# EAGLE design Esp8266_prot16_v4 (EAGLE 8.4.0)
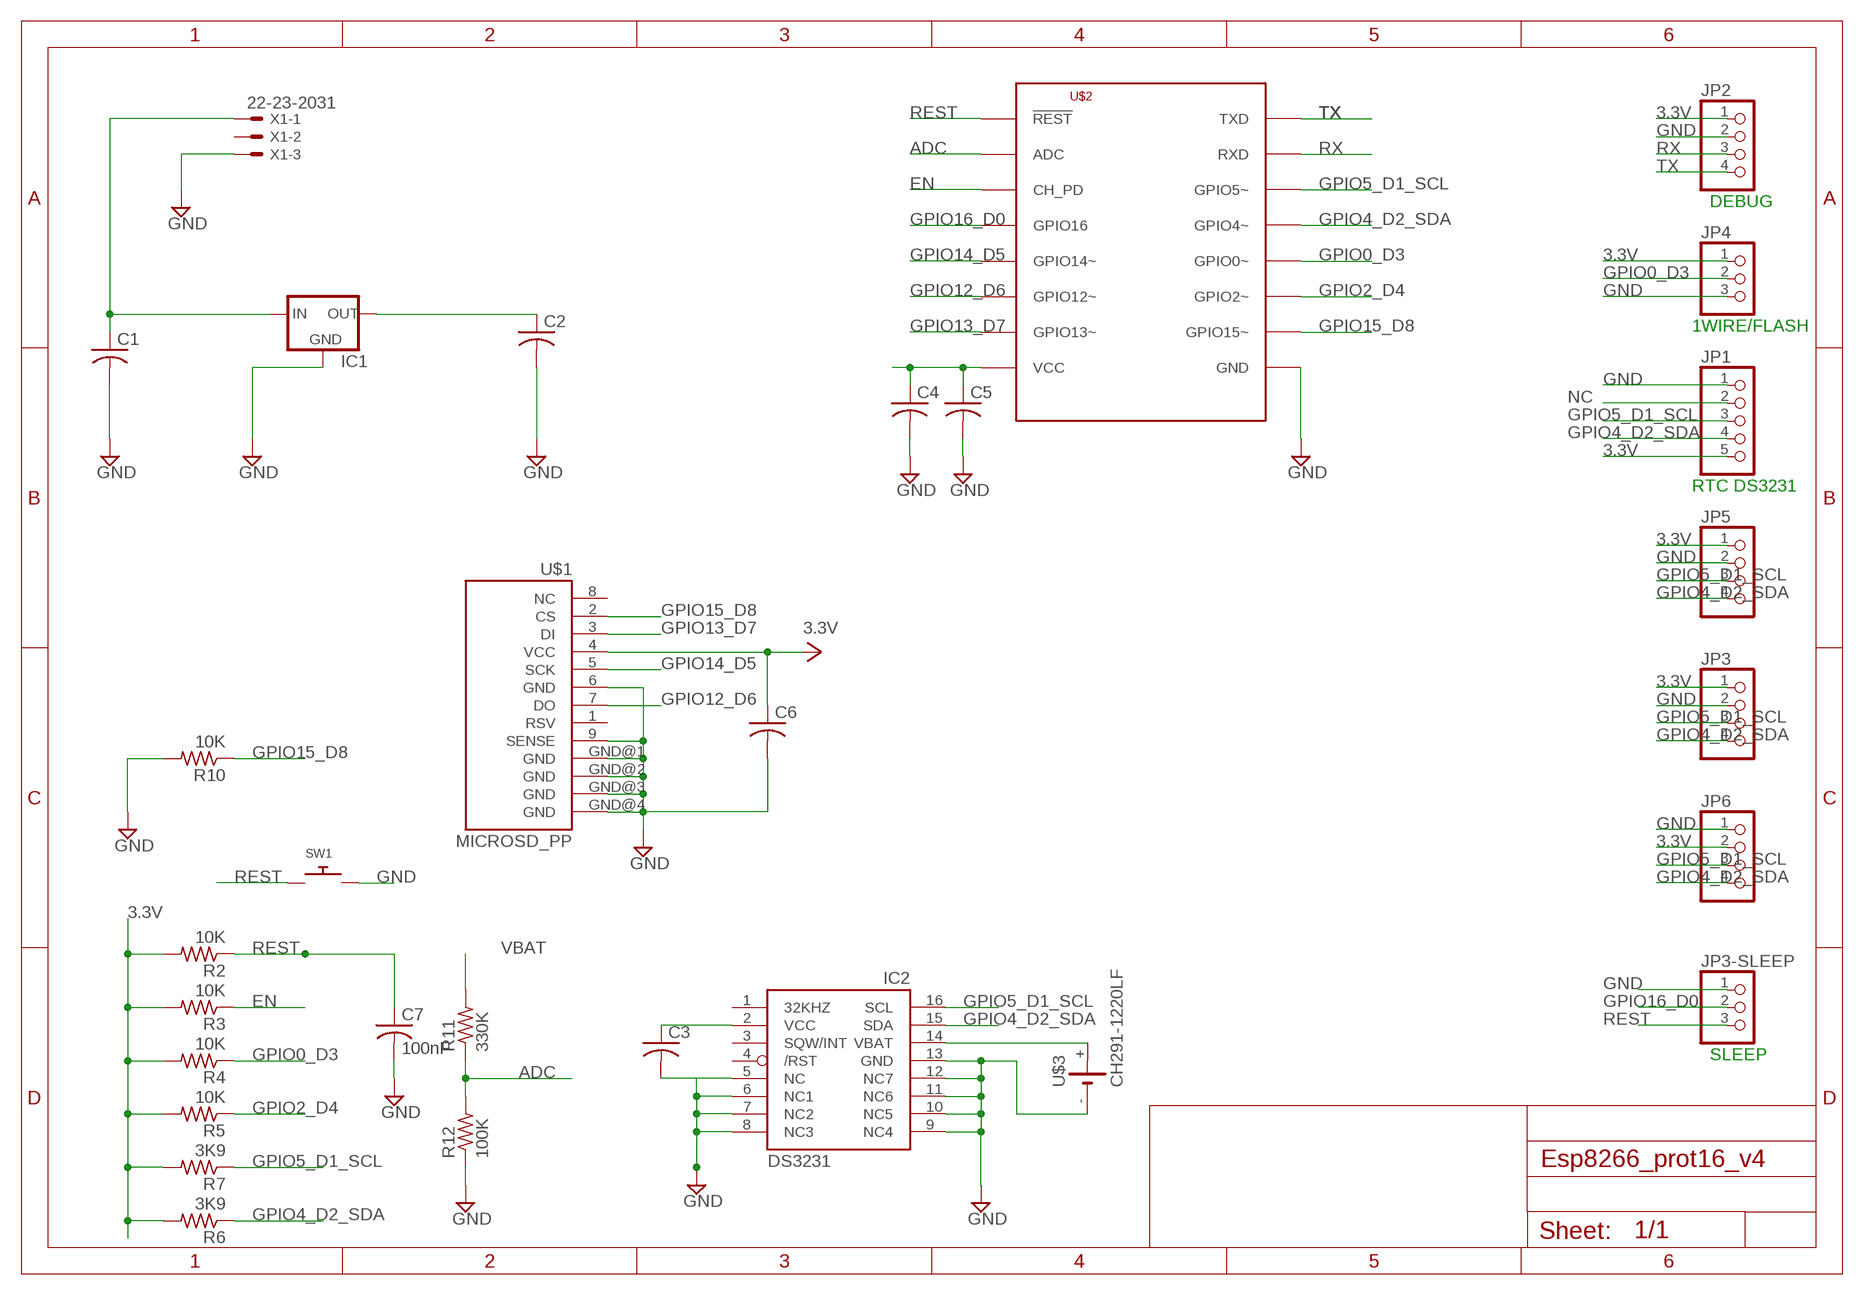
[diagram p0: schematic, sheet 1]

## Parts
C1  C-USC0805K  [C0805K]
C2  C-USC0805K  [C0805K]
C3  C-USC0805K  [C0805K]
C4  C-USC0805K  [C0805K]
C5  C-USC0805K  [C0805K]
C6  C-USC0805K  [C0805K]
C7  100nF  C-USC0805K  [C0805K]
IC1  XC63FPP  [SOT89R]
IC2  DS3231/SO  [SO16W]
JP1  PINHD-1X5/90  [1X05/90]
JP2  PINHD-1X4  [1X04]
JP3  PINHD-1X4/90  [1X04/90]
JP3-SLEEP  PINHD-1X3/90  [1X03/90]
JP4  PINHD-1X3  [1X03]
JP5  PINHD-1X4  [1X04]
JP6  PINHD-1X4  [1X04]
R2  10K  R-US_R0805  [R0805]
R3  10K  R-US_R0805  [R0805]
R4  10K  R-US_R0805  [R0805]
R5  10K  R-US_R0805  [R0805]
R6  3K9  R-US_R0805  [R0805]
R7  3K9  R-US_R0805  [R0805]
R10  10K  R-US_R0805  [R0805]
R11  330K  R-US_R0805  [R0805]
R12  100K  R-US_R0805  [R0805]
SW1  SWITCH_PUSHBUTTONEVQ-PE  [TACT_PANA-EVQ]
U$1  MICROSD_PP  [MICROSD_PP]
U$2  ESP8266-07  [ESP-07]
U$3  CH291-1220LF  [CH291-1220LF]
X1  22-23-2031  [22-23-2031]

## Nets
3.3V: C2.1 C3.1 C4.1 C5.1 C6.1 IC1.3(OUT) IC2.2(VCC) JP1.5 JP2.1 JP3.1 JP4.1 JP5.1 JP6.2 R2.2 R3.2 R4.2 R5.2 R6.2 R7.2 U$1.4(VCC) U$2.VCC
ADC: R11.1 R12.2 U$2.ADC
BATRTC: IC2.14(VBAT) U$3.+
EN: R3.1 U$2.CH_PD
GND: C1.2 C2.2 C3.2 C4.2 C5.2 C6.2 C7.2 IC1.1(GND) IC2.5(NC) IC2.6(NC1) IC2.7(NC2) IC2.8(NC3) IC2.9(NC4) IC2.10(NC5) IC2.11(NC6) IC2.12(NC7) IC2.13(GND) JP1.1 JP2.2 JP3-SLEEP.1 JP3.2 JP4.3 JP5.2 JP6.1 R10.2 R12.1 SW1.P$2 U$1.6(GND) U$1.9(SENSE) U$1.GND@1(GND) U$1.GND@2(GND) U$1.GND@3(GND) U$1.GND@4(GND) U$2.GND U$3.- X1.3
GPIO0_D3: JP4.2 R4.1 U$2.GPIO0(GPIO0~)
GPIO2_D4: R5.1 U$2.GPIO2(GPIO2~)
GPIO4_D2_SDA: IC2.15(SDA) JP1.4 JP3.4 JP5.4 JP6.4 R6.1 U$2.GPIO5(GPIO4~)
GPIO5_D1_SCL: IC2.16(SCL) JP1.3 JP3.3 JP5.3 JP6.3 R7.1 U$2.GPIO4(GPIO5~)
GPIO12_D6: U$1.7(DO) U$2.GPIO12(GPIO12~)
GPIO13_D7: U$1.3(DI) U$2.GPIO13(GPIO13~)
GPIO14_D5: U$1.5(SCK) U$2.GPIO14(GPIO14~)
GPIO15_D8: R10.1 U$1.2(CS) U$2.GPIO15(GPIO15~)
GPIO16_D0: JP3-SLEEP.2 U$2.GPIO16
NC: JP1.2
REST: C7.1 JP3-SLEEP.3 R2.1 SW1.P$1 U$2.REST(!REST)
RX: JP2.3 U$2.RXD
TX: JP2.4 U$2.TXD
VBAT: C1.1 IC1.2(IN) R11.2 X1.1
Unconnected: IC2.1(32KHZ) IC2.3(SQW/INT) IC2.4(/RST) U$1.1(RSV) U$1.8(NC) X1.2

## Notes on the sheet
- DEBUG
- 1WIRE/FLASH
- RTC DS3231
- SLEEP

## Library data of the parts
C1-C7 = adafruit:C-US: CAPACITOR, American symbol
IC1 = v-reg:XC63FP: Positiv Voltage Regulators www.torex.co.jp/english/product/pro02/pdf/0201_xc62fp.pdf
IC2 = adafruit:DS3231
JP1 = pinhead:PINHD-1X5: PIN HEADER
JP2 JP3 JP5 JP6 = pinhead:PINHD-1X4: PIN HEADER
JP3-SLEEP JP4 = pinhead:PINHD-1X3: PIN HEADER
R2-R7 R10-R12 = adafruit:R-US_: RESISTOR, American symbol
SW1 = adafruit:SWITCH_PUSHBUTTON: Buttons SOFTTOUCHSMD_SJ - Soft touch temporary push button (Super Junk Akihabara) Compatible with SKPMANE010 [Mouser: 688-SKPMAN] C&K_KSS = Digikey: KSS221GLFS
U$1 = DE1594-v2:MICROSD_PP
U$2 = lio:ESP8266
U$3 = battery:CH291-1220LF: Battery Holder, SMT, 12mm multicomp PART NO. CH291-1220LF Source: Data sheet <http://www.farnell.com/datasheets/1505860.pdf>
X1 = con-molex:22-23-2031: .100" (2.54mm) Center Header - 3 Pin; MF: MOLEX; MPN: 22-23-2031; OC_FARNELL: 1462950; OC_NEWARK: 30C0862

## Board
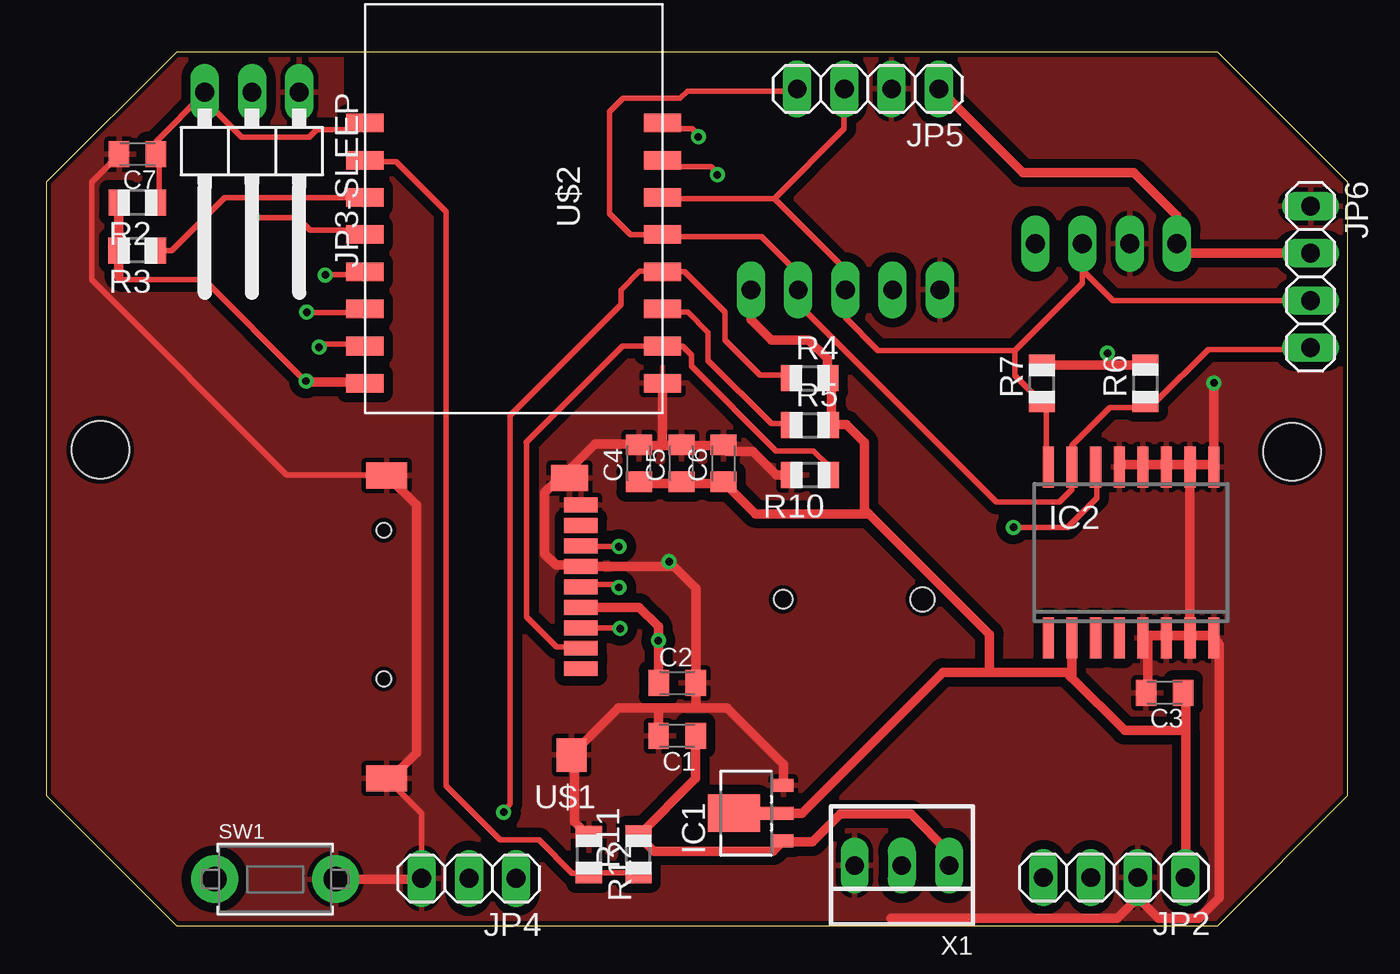
[diagram p1: board, top side]
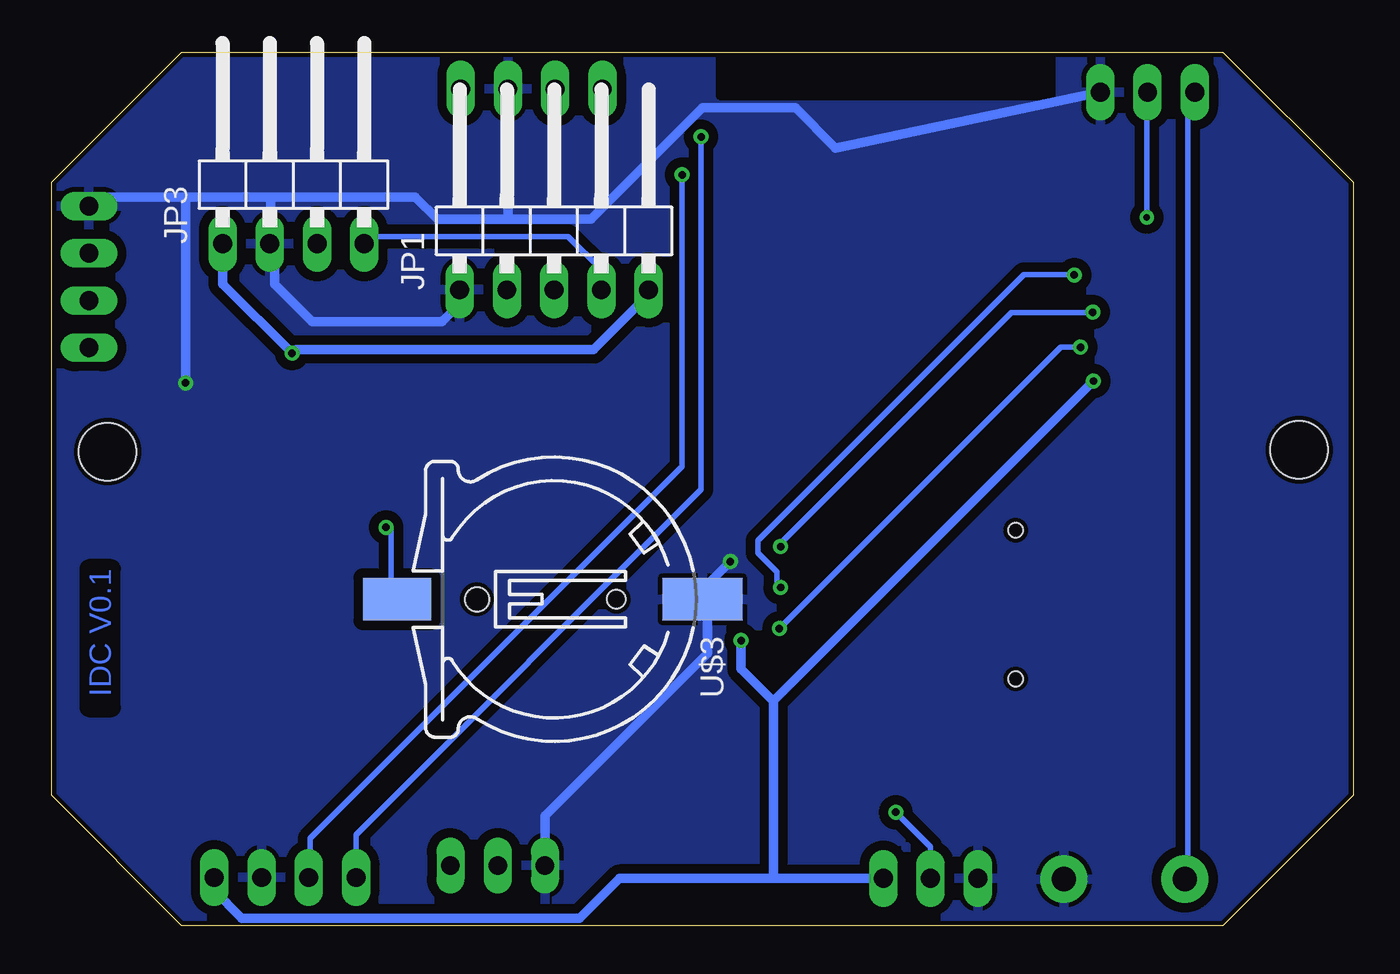
[diagram p2: board, bottom side, seen from below]

Size 70 x 47 mm. Coordinates in mm from the lower left corner, seen from the top.
Outline: 63,47 7,47 0,40 0,7 7,0 63,0 70,7 70,40 63,47
Copper layers (1*16): Top 0.035mm / dielectric 1.5mm / Bottom 0.035mm
Design rules "default *": minimum track width 0.3mm, minimum drill 0.4mm, track to track 20mil, track to pad 15mil, pad to pad 6mil, via to via 6mil, smd to smd 6mil, copper to edge 0.00761875mm, drill to drill 0.5mm, minimum pad ring 10mil, minimum via ring 8mil, stop-mask expansion 4mil, vias tented up to drill 0mil, thermal gap 10mil
Holes 3.1 mm at 2.9,25.6 67,25.5

### Footprints (pad centres in the part's own frame; a part is rotated, then mirrored left to right if it is on the bottom)
C0805K = smd 1.1 x 1.4: 1 -1,0; 2 1,0
SOT89R = smd 0.7 x 1.1: 1 1.5,-1.75; 2 -1.5,-1.75 | smd 0.7 x 1.8: 3 0,-1.4 | smd 2 x 2.8: 4 0,0.9
SO16W = smd 0.6 x 2.2: 1 -4.445,-4.6; 2 -3.175,-4.6; 3 -1.905,-4.6; 4 -0.635,-4.6; 5 0.635,-4.6; 6 1.905,-4.6; 7 3.175,-4.6; 8 4.445,-4.6; 9 4.445,4.6; 10 3.175,4.6; 11 1.905,4.6; 12 0.635,4.6; 13 -0.635,4.6; 14 -1.905,4.6; 15 -3.175,4.6; 16 -4.445,4.6
1X05/90 = drill 1.016 long: 1 -5.08,-3.81; 2 -2.54,-3.81; 3 0,-3.81; 4 2.54,-3.81; 5 5.08,-3.81
1X04 = drill 1.016 long: 1 -3.81,0; 2 -1.27,0; 3 1.27,0; 4 3.81,0
1X04/90 = drill 1.016 long: 1 -3.81,-3.81; 2 -1.27,-3.81; 3 1.27,-3.81; 4 3.81,-3.81
1X03/90 = drill 1.016 long: 1 -2.54,-3.81; 2 0,-3.81; 3 2.54,-3.81
1X03 = drill 1.016 long: 1 -2.54,0; 2 0,0; 3 2.54,0
R0805 = smd 1.1 x 1.4: 1 -1,0; 2 1,0
TACT_PANA-EVQ = drill 1.3 pad 2.54: P$1 -3.25,0; P$2 3.25,0
MICROSD_PP = smd 1.8 x 0.8: 1 0,3.85; 2 0,2.75; 3 0,1.65; 4 0,0.55; 5 0,-0.55; 6 0,-1.65; 7 0,-2.75; 8 0,-3.85; 9 0,-4.95 | smd 1.6 x 1.8: GND@1 0.5,8.5 | smd 2.2 x 1.4: GND@2 10.45,9.75; GND@4 10.45,-6.55 | smd 2 x 1.4: GND@3 0.6,-6.4 | hole 0.8: 10.6,4.4; 10.6,-3.6
ESP-07 = smd 1 x 2: ADC -1.6,-8; CH_PD 0.4,-8; GND 10.4,8; GPIO0 4.4,8; GPIO2 6.4,8; GPIO4 0.4,8; GPIO5 2.4,8; GPIO12 6.4,-8; GPIO13 8.4,-8; GPIO14 4.4,-8; GPIO15 8.4,8; GPIO16 2.4,-8; REST -3.6,-8; RXD -1.6,8; TXD -3.6,8; VCC 10.4,-8
CH291-1220LF = smd 2.3 x 3.66: + 0,-2.296 | smd 2.3 x 4.3: - 0,14.146 | hole 1.3: 0,2 | hole 1: 0,9.5
22-23-2031 = drill 1 long: 1 -2.54,0; 2 0,0; 3 2.54,0

### Placement (x,y rotation side)
C1  33.92,10.21 180 top
C2  33.93,13.05 0 top
C3  60.15,12.53 180 top
C4  31.87,24.87 90 top
C5  34.15,24.87 90 top
C6  36.42,24.87 90 top
C7  4.9,41.5 180 top
IC1  37.89,6.05 90 top
IC2  58.34,20.07 0 top
JP1  42.98,38.01 0 bottom
JP2  57.45,2.58 180 top
JP3  57,40.5 0 bottom
JP3-SLEEP  11.05,41.02 180 top
JP4  22.72,2.53 180 top
JP5  44.2,45.01 180 top
JP6  68,34.9 270 top
R2  4.89,38.9 180 top
R3  4.88,36.32 180 top
R4  41.07,29.45 0 top
R5  41.08,26.92 0 top
R6  59.12,29.18 90 top
R7  53.55,29.17 90 top
R10  41.07,24.23 180 top
R11  31.84,3.83 90 top
R12  29.17,3.82 270 top
SW1  12.3,2.5 0 top
U$1  28.75,17.67 180 top
U$2  25.13,39.58 270 top
U$3  49.13,17.55 270 bottom
X1  46.01,3.24 180 top

### Tracks (layer width: path | path; a pad name or v marks a point on that pad's centre or on a via)
3.3V  (via drill 0.4)
  Top 0.3: 32.17,23.79 C4.1 | 33.87,23.79 C5.1 34.21,23.79 | 36.25,23.79 C6.1 36.59,23.84 | 59.1,30.17 R6.2 | 57.08,30.2 57.11,30.17 | 17.02,29.24 U$2.VCC | 13.96,29.24 v13.96,29.29 13.74,29.49 8.48,34.74 4.04,34.74 3.88,34.92 | 48.01,44.9 JP5.1 | 42.22,27.24 42.09,26.96 R5.2 42.22,26.9 | 42.22,29.28 R4.2 | 61.29,12.26 C3.1 | 61.29,2.72 JP2.1 | 55.16,14.3 55.16,15.32 IC2.2 | 3.89,36.4 3.89,36.23 R3.2 | 32.91,13.07 C2.1
  Top 0.5: 33.87,23.79 32.17,23.79 | 36.25,23.79 34.21,23.79 | 59.1,30.17 57.11,30.17 R7.2 | v57.08,30.79 57.08,30.2 | 13.96,29.24 17.02,29.24 | JP5.1 52.52,40.5 58.5,40.5 60.81,38.19 JP3.1 61.33,36.17 JP6.2 | 42.22,29.28 42.22,27.24 | 61.29,10.5 61.29,2.72 | 61.29,10.5 61.29,12.26 | 44.24,22.15 50.73,15.66 50.73,13.62 | R4.2 42,29.51 42,30.5 41,31.5 39,31.5 37.9,32.6 JP1.5 | 55.17,13.33 IC2.2 | 55.17,13.33 58,10.5 61.29,10.5 | C6.1 38.13,22.15 44.24,22.15 | 44.24,22.15 44,22.4 44,26 43.04,26.96 42.09,26.96 | v32.91,15.34 32.91,16.09 31.88,17.12 U$1.4 | 55.17,13.33 54.88,13.62 50.73,13.62 | v32.91,15.34 32.9,15.32 | IC1.3 40.65,6.05 48.22,13.62 50.73,13.62 | 3.89,36.4 R2.2 | v13.96,29.29 v13.95,29.3 | 3.88,34.92 R3.2 | v32.91,15.34 32.91,13.07
  Bottom 0.3: 32.69,15.28 v32.91,15.34 | 56.86,30.94 v57.08,30.79 56.86,30.98 | 61.29,2.38 JP2.1 | 37.8,34.05 JP1.5
  Bottom 0.5: JP3.1 60.81,34.52 v57.08,30.79 | 56.86,30.98 40.86,30.98 37.8,34.05 | v32.91,15.34 32.91,13.8 31.18,12.07 | 31.18,12.07 v13.96,29.29 | 61.29,2.38 61.29,1.91 59.77,0.4 41.6,0.4 39.47,2.53 31,2.53 | 31,2.53 JP4.1 | 31.18,12.07 31.18,2.71 31,2.53
ADC
  Top 0.3: U$2.ADC 17.14,41.09 18.81,41.09 21.49,38.4 21.49,7.5 24.4,4.6 26.5,4.6 28.28,2.82 R12.2 29.19,2.83 R11.1
BATRTC  (via drill 0.4)
  Top 0.3: v52.02,21.43 54.93,21.43 56.5,23 56.5,24.61 IC2.14
  Bottom 0.3: v52.02,21.43 51.76,21.41 51.76,17.66 U$3.+
EN
  Top 0.3: U$2.CH_PD 17.02,38.77 | U$2.CH_PD 16.81,39.5 | 6.06,36.36 R3.1 6.72,36.32 9.58,39.18 U$2.CH_PD
GND  (via drill 0.4, 0.4 pad 0.7)
  Top 0.3: U$1.GND@2 18.39,7.79 18.73,7.79 U$1.GND@2 | 18.39,24.13 U$1.GND@4 18.18,24.24 12.93,24.24 2.42,34.74 2.42,40 3.64,41.21 C7.2 | 18.05,7.79 U$1.GND@2 | 57.88,24.81 IC2.13 | 58.91,24.81 IC2.12 59.25,24.81 | 61.29,24.81 IC2.10 | 60.27,24.81 IC2.11 | 62.65,15.62 IC2.8 62.65,15.32 | C3.2 59.25,12.56 | 59.25,15.28 IC2.5 59.25,15.62 | 61.29,15.62 IC2.7 61.63,15.62 | 60.27,15.62 IC2.6 | 61.63,24.47 IC2.10 | 32.17,25.84 C4.2 31.83,25.84 | 33.87,25.84 C5.2 | 36.25,25.84 C6.2 | 34.21,25.84 C5.2 | 39.98,24.34 R10.2 39.84,24.52 | 36.59,25.84 C6.2 | 33.37,28.9 U$2.GND | 33.87,26.18 C5.2 | 28.94,19.37 U$1.6 28.6,19.37 | 33.74,19.32 v33.49,19.58 33.71,19.37 | 28.26,9.15 U$1.GND@1 | 28.26,24.13 U$1.GND@3 27.92,23.79 27.58,23.79 | 62.8,24.8 IC2.9 | IC2.10 61.52,24.8 | 18.05,7.83 U$1.GND@2 | 36.59,25.88 C6.2 | 35,12.98 C2.2 | 34.93,11.73 34.9,11.7 | 32.92,11.52 33.1,11.7 | JP4.3 20.18,6.03 U$1.GND@2
  Top 0.5: 58.91,24.81 57.88,24.81 | 59.25,24.81 60.27,24.81 61.29,24.81 | 62.65,15.62 61.63,15.62 | 59.25,15.28 59.25,12.56 | 59.25,15.62 60.27,15.62 61.29,15.62 | 33,25.84 33.87,25.84 | 33,25.84 32.17,25.84 | 34.21,25.84 36.25,25.84 36.59,25.5 38,25.5 39.27,24.23 R10.2 | 33.74,19.32 U$1.6 28.68,19.39 27.59,19.39 27.58,19.4 27.4,19.4 26.8,20 26.8,23.3 27.29,23.79 27.58,23.79 | v62.8,29.2 62.8,24.8 61.52,24.8 | U$2.GND 33.13,25.97 33,25.84 | 39.45,7.55 IC1.1 39.64,8.66 36.6,11.7 34.9,11.7 33.1,11.7 30.78,11.7 U$1.GND@1 28.42,9 28.42,5.58 R12.1 | 58.72,1.5 58.72,1.49 59.8,0.4 62,0.4 63.1,1.5 63.1,15.16 IC2.8 | 58.72,1.5 JP2.2 | 45.44,0.4 57.61,0.4 58.72,1.5 | U$1.GND@4 19.9,22.62 19.9,9.3 18.39,7.79 | C4.2 31.84,25.9 29.5,25.9 28.26,24.66 28.26,24.13 | IC2.10 IC2.7 | v33.49,19.58 34.93,18.14 C2.2 34.93,11.73 | C1.2 32.92,11.52 | SW1.P$2 20.15,2.5 JP4.3
  Bottom 0.3: 34.73,18.34 34.73,17.66 34.95,17.57 U$3.- 34.73,17.32 | 34.73,14.6 34.73,14.64 | 45.63,44.9 JP5.2 | 67.93,38.63 JP6.1 | 45.47,38.06 45.53,38 | 58.23,36.77 JP3.2
  Bottom 0.5: JP3-SLEEP.1 27.84,41.84 30,44 35,44 41,38 45.53,38 49.25,38 50.45,39.2 58.23,39.2 | 34.73,17.32 34.73,14.64 43.47,5.9 X1.3 | 58.23,39.2 63,39.2 | JP5.2 45.47,38.06 | 63,39.2 67.36,39.2 67.93,38.63 | v62.8,29.2 62.8,39 63,39.2 | JP1.1 48.06,33.44 49,32.5 56,32.5 58,34.5 58,36.42 JP3.2 | 58.23,39.2 58.23,36.77 | v33.49,19.58 34.95,18.13 34.95,17.57
  pour Bottom (isolate 0.254): 0,7 7,0 63,0 70,7 70,40 63,47 7,47 0,40
  pour Top (isolate 0.254): 0,40 0,7 7,0 63,0 70,7 70,40 63,47 7,47
GPIO0_D3  (via drill 0.4)
  Top 0.3: 33.37,35.37 U$2.GPIO0 | R4.1 39.84,29.62 38.38,29.62 36.5,31.5 36.5,33 34.32,35.18 U$2.GPIO0 | 33.37,35.41 U$2.GPIO0 | U$2.GPIO0 33.31,35 | U$2.GPIO0 32.96,35.2 31.9,35.2 30.9,34.2 30.9,33.4 24.94,27.43 24.94,6.54 v24.6,6.1
  Bottom 0.3: 24.5,6 v24.6,6.1 22.73,4.22 JP4.2
GPIO2_D4
  Top 0.3: 33.37,33.33 U$2.GPIO2 | 39.84,27.24 R5.1 39.99,27 39,27 35.6,30.4 35.6,31.9 34.5,33 33.31,33 U$2.GPIO2 | 33.37,33.03 U$2.GPIO2
GPIO4_D2_SDA
  Top 0.3: R6.1 58.91,27.88 57.2,27.88 55.16,25.84 55.16,24.81 IC2.15 55.16,24.47 55.16,23.45 54.5,22.79 51.1,22.79 40.44,33.45 | U$2.GPIO5 33.37,37.07 38.48,37.07 40.44,35.11 JP1.4 40.44,33.45 | 32.35,37.41 33.03,37.41 U$2.GPIO5 | JP5.4 40.18,44.9 34.48,44.9 34.08,44.51 31.01,44.51 30.3,43.8 30.3,38.3 31.42,37.18 U$2.GPIO5 | 59.25,28.22 R6.1 | 40.44,33.45 40.34,33.55 | R6.1 59.68,28.18 62.5,31 67.91,31 JP6.4
  Bottom 0.3: JP3.4 52.81,37.07 42.22,37.07 40.44,35.29 JP1.4
GPIO5_D1_SCL
  Top 0.3: IC2.16 53.8,24.81 53.8,27.88 R7.1 53.46,28.22 52.1,29.58 52.1,30.94 | 39.16,39.11 33.37,39.11 U$2.GPIO4 | 39.16,39.11 42.9,42.86 42.9,44.9 JP5.3 | 42.98,34.4 42.98,32.7 44.74,30.94 52.1,30.94 | 42.98,34.4 JP1.3 | 42.98,34.4 42.98,35.29 39.16,39.11 | JP6.3 57.37,33.63 55.73,35.27 | JP3.3 55.73,35.27 | 52.1,30.94 55.73,34.58 55.73,35.27
GPIO12_D6  (via drill 0.4)
  Top 0.3: v30.79,20.39 30.64,20.39 28.94,20.39 U$1.7 | v14,33 14.3,32.99 17.02,32.99 U$2.GPIO12
  Bottom 0.3: v30.79,20.39 30.64,20.73 18.39,32.99 14.3,32.99 v14,33
GPIO13_D7  (via drill 0.4)
  Top 0.3: 17.37,31.28 U$2.GPIO13 17.02,31.28 14.98,31.28 v14.66,31.11 14.7,31.08 | U$1.3 30.78,16.02 v30.86,15.98
  Bottom 0.3: v30.86,15.98 15.72,31.11 v14.66,31.11
GPIO14_D5  (via drill 0.4)
  Top 0.3: v30.79,18.19 30.64,18.34 28.94,18.34 U$1.5 | v15,35 15.32,35.03 17.02,35.03 U$2.GPIO14
  Bottom 0.3: v30.79,18.19 30.98,18.34 30.98,19.02 32.01,20.05 32.01,20.73 17.71,35.03 15.32,35.03 v15,35
GPIO15_D8
  Top 0.3: 28.6,14.94 U$1.2 28.68,14.99 27.43,14.99 25.82,16.6 25.82,25.98 25.8,26 30.98,31.18 U$2.GPIO15 | 33.03,30.94 U$2.GPIO15 | R10.1 42.08,24.72 41.26,25.54 39.26,25.54 34.7,30.09 34.7,30.7 34.22,31.18 U$2.GPIO15 | 33.37,31.33 U$2.GPIO15 | U$2.GPIO15 33.31,31
GPIO16_D0  (via drill 0.35)
  Top 0.3: U$2.GPIO16 17.02,37.41 14.19,37.41 13.5,38.1 v11.1,38.1
  Bottom 0.3: v11.1,38.1 11.1,44.79 JP3-SLEEP.2
REST
  Top 0.3: 17.02,43.2 U$2.REST 16.97,42.82 14.54,42.82 14.14,42.42 10.5,42.42 8.51,44.41 8.51,44.8 | R2.1 6.06,39.19 6.06,41.21 C7.1 | 6.06,41.61 C7.1 | 8.51,44.8 JP3-SLEEP.3 | C7.1 5.9,42.19 8.51,44.8
  Bottom 0.3: JP3-SLEEP.3 8.89,44.44 8.89,2.83 SW1.P$1
RX  (via drill 0.4)
  Top 0.3: U$2.RXD 33.37,40.82 35.75,40.82 36.09,40.48 v36.09,40.4
  Bottom 0.3: v36.09,40.4 36.09,24.71 56.1,4.7 56.1,2.66 JP2.3
TX  (via drill 0.4)
  Top 0.3: 34.05,42.86 33.37,42.86 U$2.TXD 34.05,42.86 | 34.05,42.86 34.73,42.86 35.07,42.52 v35.07,42.44
  Bottom 0.3: v35.07,42.44 35.07,23.45 53.63,4.89 JP2.4
VBAT
  Top 0.5: X1.1 48.55,3.95 46.5,6 42.7,6 41.2,4.5 39.69,4.5 IC1.2 39.09,4 32.68,4 R11.2 34.92,7.91 C1.1

### Text on the board
Bottom: IDC V0.1